# Altium schematic sheet CPU.SchDoc
size A3
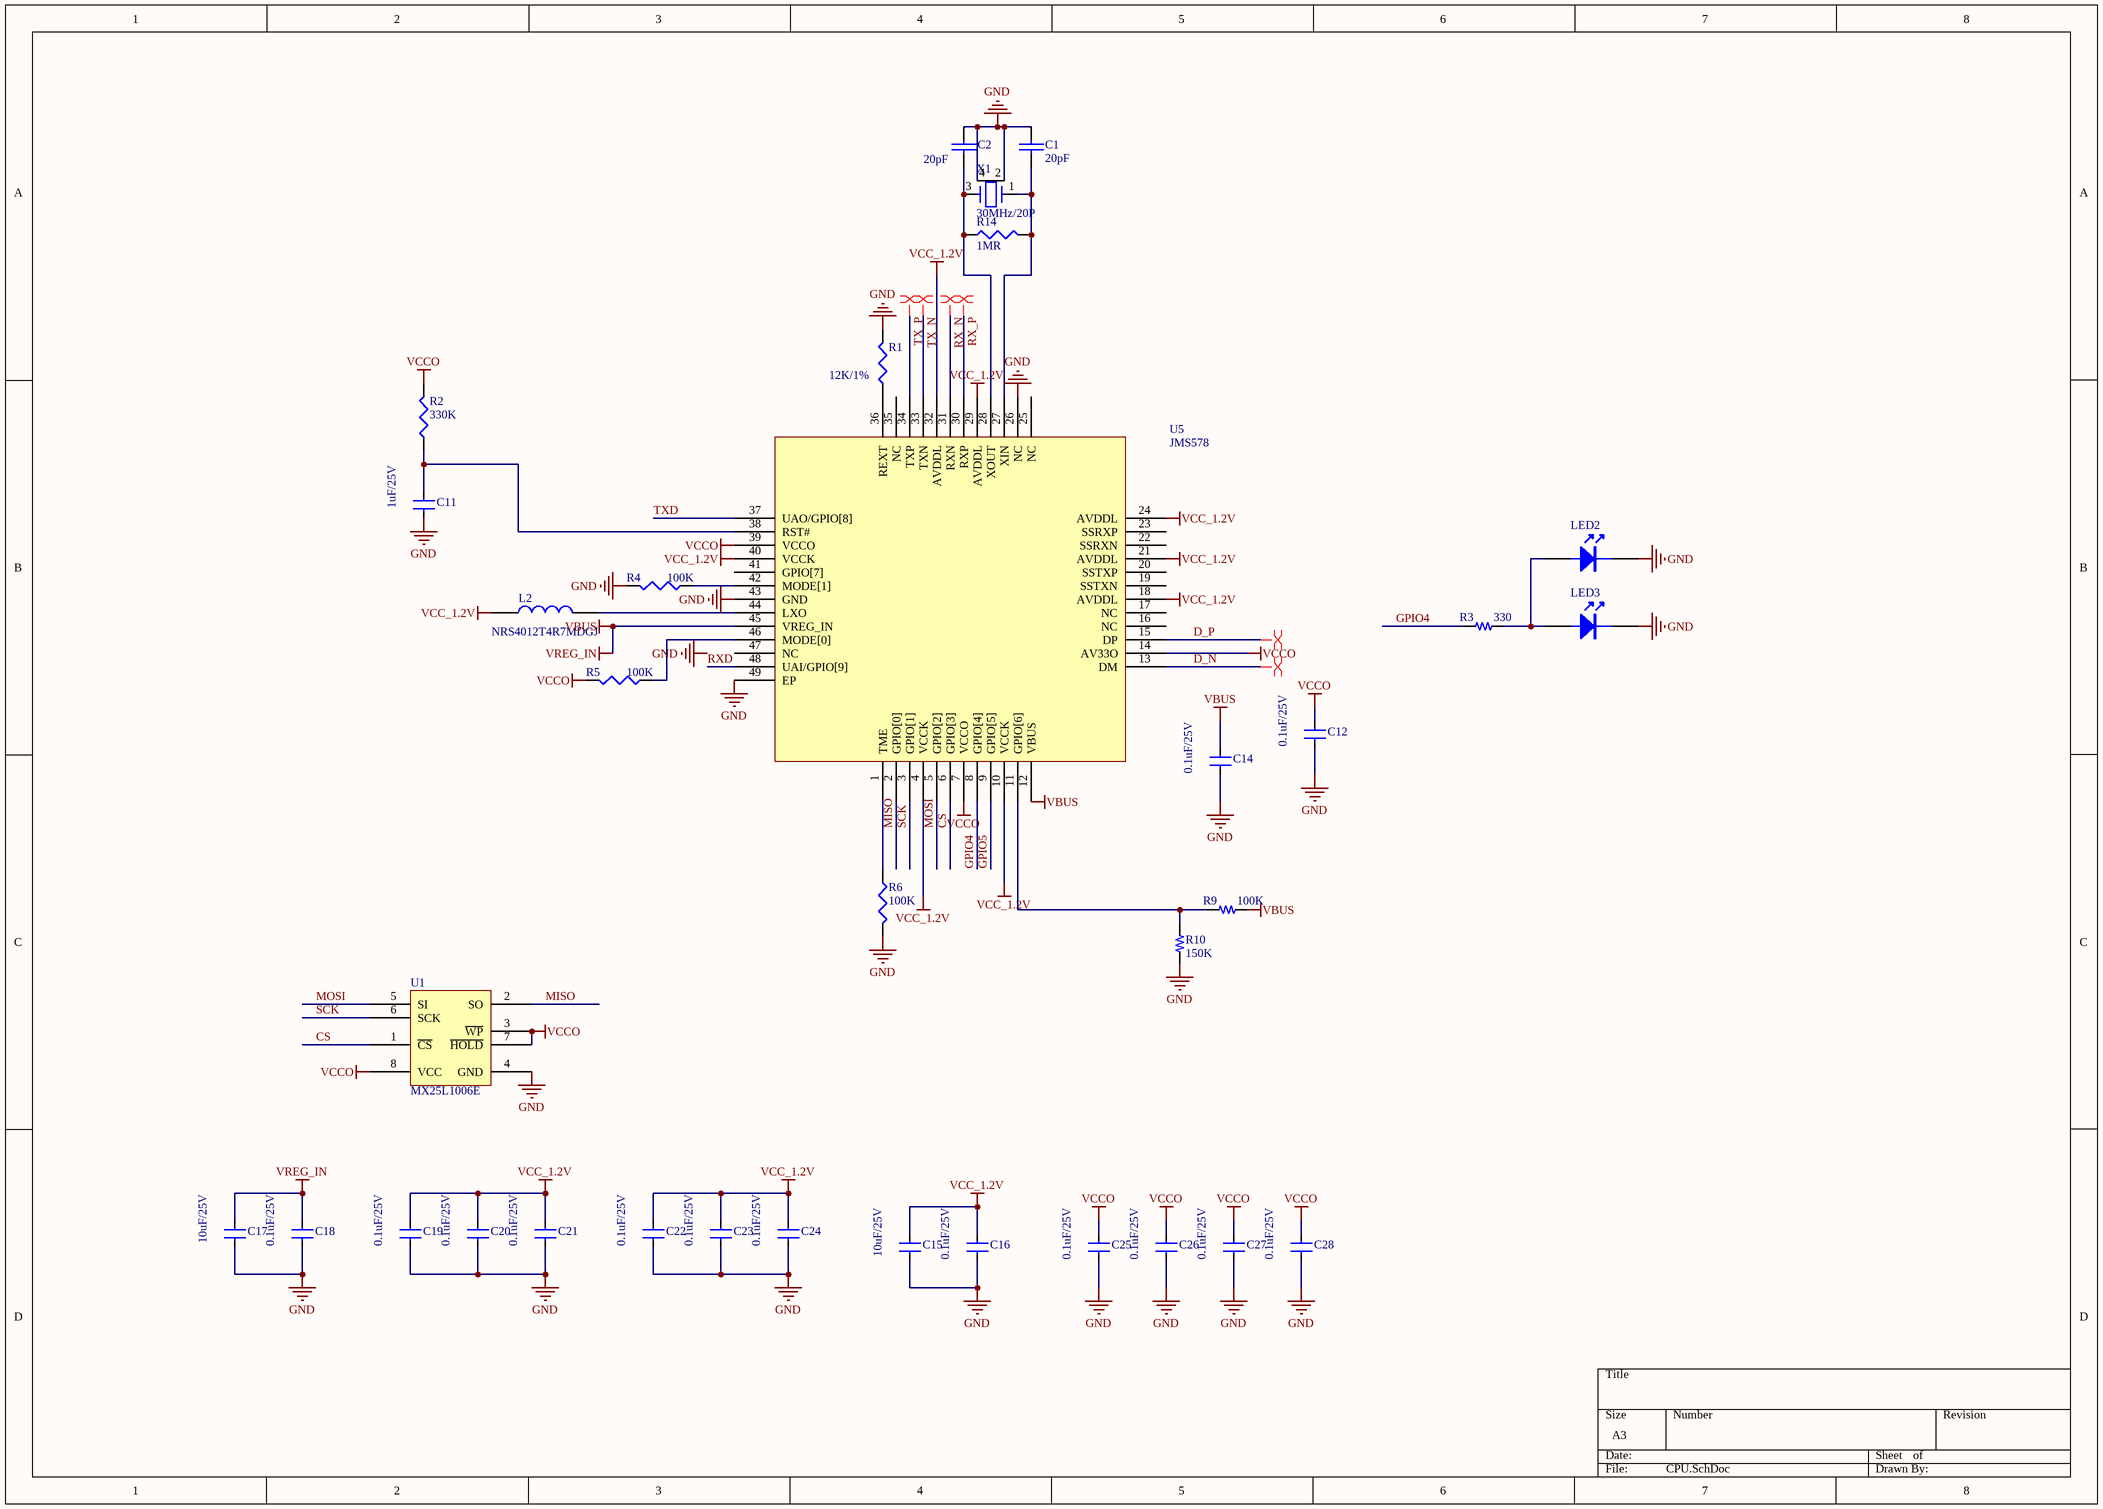
[diagram p0: CPU.SchDoc]

## Parts
C1  20pF  [0603c]
C2  20pF  [0603C]
C11  1uF/25V  [0603C]
C12  0.1uF/25V  [0603C]
C14  0.1uF/25V  [0603C]
C15  10uF/25V  [0603C]
C16  0.1uF/25V  [0603C]
C17  10uF/25V  [0603C]
C18  0.1uF/25V  [0603C]
C19  0.1uF/25V  [0603C]
C20  0.1uF/25V  [0603C]
C21  0.1uF/25V  [0603C]
C22  0.1uF/25V  [0603C]
C23  0.1uF/25V  [0603C]
C24  0.1uF/25V  [0603C]
C25  0.1uF/25V  [0603C]
C26  0.1uF/25V  [0603C]
C27  0.1uF/25V  [0603C]
C28  0.1uF/25V  [0603C]
L2  NRS4012T4R7MDGJ  [NRS4012T4R7MDGJ]
LED2  (no value)  [0603LED]
LED3  (no value)  [0603LED]
R1  12K/1%  [0603R]
R2  330K  [0603R]
R3  330  [0603R]
R4  100K  [0603R]
R5  100K  [0603R]
R6  100K  [0603R]
R9  100K  [0603R]
R10  150K  [0603R]
R14  1MR  [0603R]
U1  MX25L1006E  [SO-8]
U5  JMS578  [QFN400P600-8N]
X1  30MHz/20P  [XTAL4TN_3225]

## Nets
GND: C1.1 C2.1 C11.2 C12.2 C14.2 C15.2 C16.2 C17.2 C18.2 C19.2 C20.2 C21.2 C22.2 C23.2 C24.2 C25.2 C26.2 C27.2 C28.2 LED2.2 LED3.2 R1.2 R4.2 R6.2 R10.1 U1.4(GND) U5.26(NC) U5.43(GND) U5.49(EP) X1.2(GND) X1.4(GND)
VBUS: C14.1 C17.1 C18.1 R9.2 U5.12(VBUS) U5.45(VREG_IN)  [also labelled VREG_IN]
VCC_1.2V: C15.1 C16.1 C19.1 C20.1 C21.1 C22.1 C23.1 C24.1 L2.1 U5.4(VCCK) U5.10(VCCK) U5.18(AVDDL) U5.21(AVDDL) U5.24(AVDDL) U5.29(AVDDL) U5.32(AVDDL) U5.40(VCCK)
VCCO: C12.1 C25.1 C26.1 C27.1 C28.1 R2.2 R5.2 U1.3(~{WP}) U1.7(~{HOLD}) U1.8(VCC) U5.7(VCCO) U5.14(AV33O) U5.39(VCCO)
CS: U1.1(~{CS}) U5.6(GPIO[3])
D_N: U5.13(DM)
D_P: U5.15(DP)
GPIO4: R3.1 U5.8(GPIO[4])
GPIO5: U5.9(GPIO[5])
MISO: U1.2(SO) U5.2(GPIO[0])
MOSI: U1.5(SI) U5.5(GPIO[2])
RX_N: U5.31(RXN)
RX_P: U5.30(RXP)
RXD: U5.48(UAI/GPIO[9])
SCK: U1.6(SCK) U5.3(GPIO[1])
TX_N: U5.33(TXN)
TX_P: U5.34(TXP)
TXD: U5.37(UAO/GPIO[8])
NetC1_2: C1.2 R14.2 U5.27(XIN) X1.1(X1)
NetC2_2: C2.2 R14.1 U5.28(XOUT) X1.3(X2)
NetC11_1: C11.1 R2.1 U5.38(RST#)
NetL2_2: L2.2 U5.44(LXO)
NetLED2_1: LED2.1 LED3.1 R3.2
NetR1_1: R1.1 U5.36(REXT)
NetR4_1: R4.1 U5.42(MODE[1])
NetR5_1: R5.1 U5.46(MODE[0])
NetR6_1: R6.1 U5.1(TME)
NetR9_1: R9.1 R10.2 U5.11(GPIO[6])

Not connected (* = marked no-connect by the designer): U5 16(NC) 17(NC) 19(SSTXN) 20(SSTXP) 22(SSRXN) 23(SSRXP) 25(NC) 35(NC) 41(GPIO[7]) 47(NC)

## Layout directives
differential pair: D_N, D_P, RX_N, RX_P, TX_N, TX_P

## Notes on the sheet
- Labels drawn without touching a wire or pin: GND

## Library data of the parts
C1 C2 = CAP: Capacitor
C11 C12 C14-C28 = 0.01UF: CCX85-103
L2 = INDUCTOR
LED2 LED3 = LED
R1 R2 R4-R6 R14 = Res3: Resistor; Published: 8-Jun-2000; LatestRevisionDate: 29-May-2009; LatestRevisionNote: IPC-7351 Footprint Added.; PackageReference: J1-0603; Publisher: Altium Limited; PackageDescription: Chip Resistor
R3 R9 R10 = R
U1 = M25P40-VMN6
X1 = CRYSTAL_2